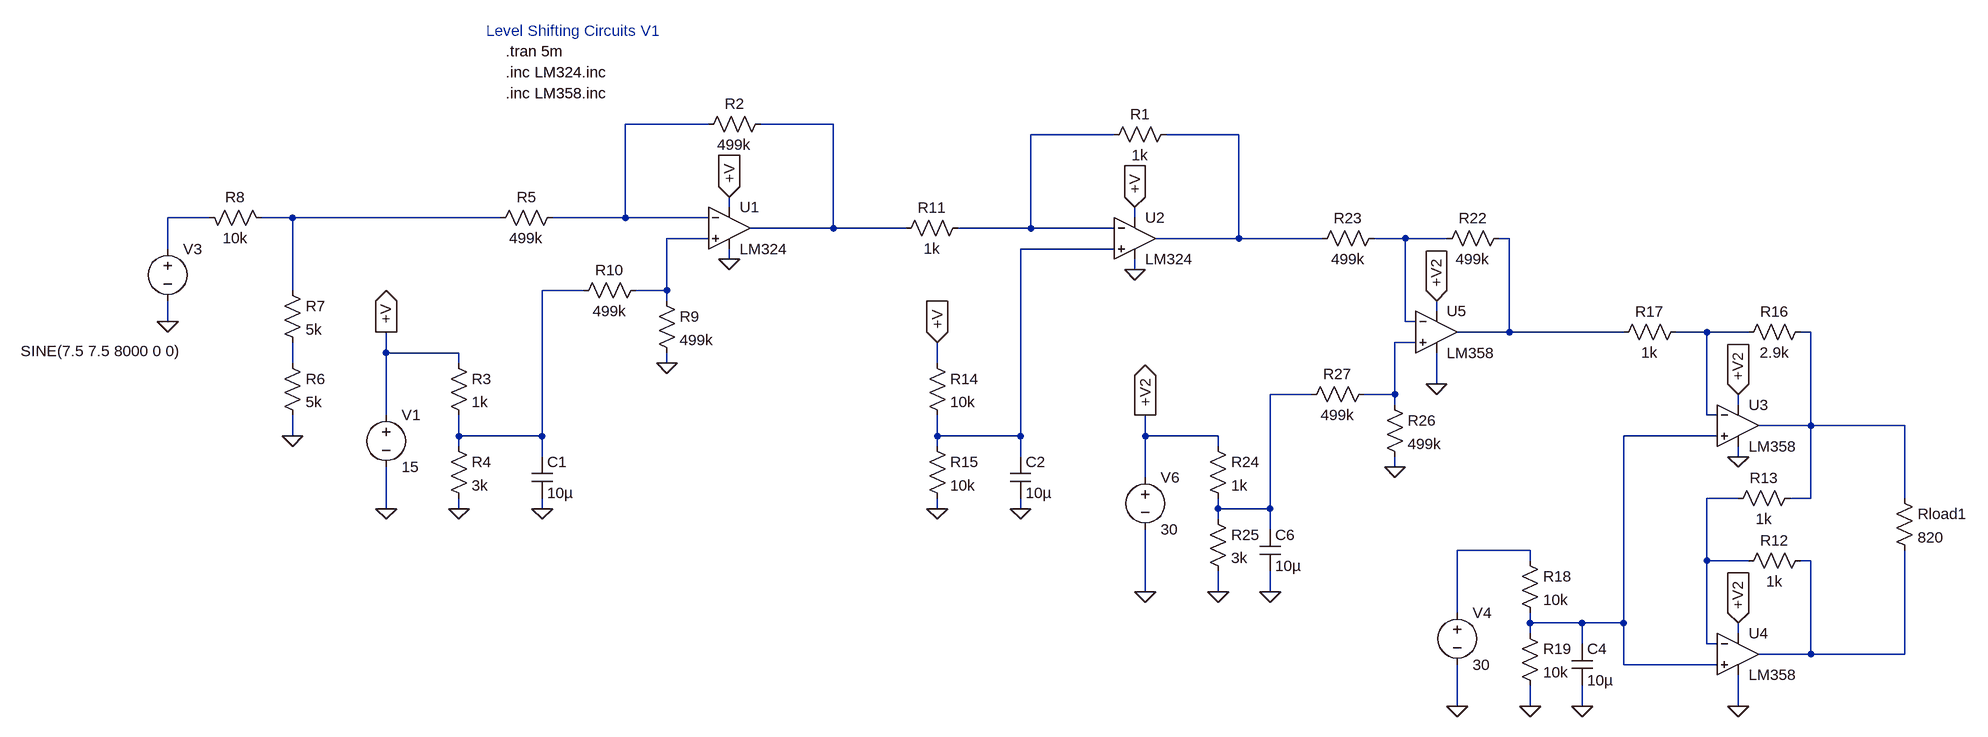
[diagram p0: schematic Level_shifting_opamps_v1.asc]
Level_shifting_opamps_v1.asc, the LTspice schematic file:
Version 4
SHEET 1 2336 1060
WIRE 80 -192 -48 -192
WIRE 272 -192 160 -192
WIRE 704 -176 576 -176
WIRE 896 -176 784 -176
WIRE 112 -64 112 -80
WIRE -688 -48 -752 -48
WIRE -560 -48 -608 -48
WIRE -240 -48 -560 -48
WIRE -48 -48 -48 -192
WIRE -48 -48 -160 -48
WIRE 80 -48 -48 -48
WIRE 736 -48 736 -64
WIRE 272 -32 272 -192
WIRE 272 -32 144 -32
WIRE 384 -32 272 -32
WIRE 576 -32 576 -176
WIRE 576 -32 464 -32
WIRE 704 -32 576 -32
WIRE 80 -16 16 -16
WIRE 896 -16 896 -176
WIRE 896 -16 768 -16
WIRE 1024 -16 896 -16
WIRE 1152 -16 1104 -16
WIRE 1216 -16 1152 -16
WIRE 1312 -16 1296 -16
WIRE -752 0 -752 -48
WIRE 704 0 560 0
WIRE 112 16 112 0
WIRE 736 32 736 16
WIRE -560 64 -560 -48
WIRE -112 64 -176 64
WIRE 16 64 16 -16
WIRE 16 64 -32 64
WIRE 16 80 16 64
WIRE 1200 96 1200 80
WIRE -752 112 -752 80
WIRE 1152 112 1152 -16
WIRE 1168 112 1152 112
WIRE 1312 128 1312 -16
WIRE 1312 128 1232 128
WIRE 1488 128 1312 128
WIRE 1616 128 1568 128
WIRE 1680 128 1616 128
WIRE 1776 128 1760 128
WIRE 1168 144 1136 144
WIRE -416 160 -416 128
WIRE -304 160 -416 160
WIRE -560 176 -560 144
WIRE -304 176 -304 160
WIRE 16 176 16 160
WIRE 432 176 432 144
WIRE 1200 208 1200 160
WIRE 1008 224 944 224
WIRE 1136 224 1136 144
WIRE 1136 224 1088 224
WIRE 1136 240 1136 224
WIRE 1664 240 1664 224
WIRE -416 256 -416 160
WIRE 1616 256 1616 128
WIRE 1632 256 1616 256
WIRE 1776 272 1776 128
WIRE 1776 272 1696 272
WIRE 1920 272 1776 272
WIRE -560 288 -560 256
WIRE -304 288 -304 256
WIRE -176 288 -176 64
WIRE -176 288 -304 288
WIRE 432 288 432 256
WIRE 560 288 560 0
WIRE 560 288 432 288
WIRE 752 288 752 256
WIRE 864 288 752 288
WIRE 1632 288 1488 288
WIRE -304 304 -304 288
WIRE 432 304 432 288
WIRE 864 304 864 288
WIRE -176 320 -176 288
WIRE 560 320 560 288
WIRE 1664 320 1664 304
WIRE 1136 336 1136 320
WIRE 752 352 752 288
WIRE 1664 384 1616 384
WIRE 1776 384 1776 272
WIRE 1776 384 1744 384
WIRE 1920 384 1920 272
WIRE -416 400 -416 336
WIRE -304 400 -304 384
WIRE -176 400 -176 384
WIRE 432 400 432 384
WIRE 560 400 560 384
WIRE 864 400 864 384
WIRE 944 400 944 224
WIRE 944 400 864 400
WIRE 864 416 864 400
WIRE 944 432 944 400
WIRE 1344 464 1232 464
WIRE 1344 480 1344 464
WIRE 1616 480 1616 384
WIRE 1680 480 1616 480
WIRE 1776 480 1760 480
WIRE 752 528 752 432
WIRE 864 528 864 496
WIRE 944 528 944 496
WIRE 1232 560 1232 464
WIRE 1344 576 1344 560
WIRE 1424 576 1344 576
WIRE 1488 576 1488 288
WIRE 1488 576 1424 576
WIRE 1344 592 1344 576
WIRE 1664 592 1664 576
WIRE 1424 608 1424 576
WIRE 1616 608 1616 480
WIRE 1632 608 1616 608
WIRE 1776 624 1776 480
WIRE 1776 624 1696 624
WIRE 1920 624 1920 464
WIRE 1920 624 1776 624
WIRE 1488 640 1488 576
WIRE 1632 640 1488 640
WIRE 1232 704 1232 640
WIRE 1344 704 1344 672
WIRE 1424 704 1424 672
WIRE 1664 704 1664 656
FLAG -416 400 0
FLAG -416 128 +V
IOPIN -416 128 Out
FLAG 112 -80 +V
IOPIN 112 -80 In
FLAG -304 400 0
FLAG 112 16 0
FLAG -560 288 0
FLAG -752 112 0
FLAG -176 400 0
FLAG 16 176 0
FLAG 736 -64 +V
IOPIN 736 -64 In
FLAG 736 32 0
FLAG 432 400 0
FLAG 560 400 0
FLAG 1232 704 0
FLAG 1664 576 +V2
IOPIN 1664 576 In
FLAG 1664 224 +V2
IOPIN 1664 224 In
FLAG 1344 704 0
FLAG 1424 704 0
FLAG 1664 320 0
FLAG 1664 704 0
FLAG 752 528 0
FLAG 752 256 +V2
IOPIN 752 256 Out
FLAG 1200 80 +V2
IOPIN 1200 80 In
FLAG 864 528 0
FLAG 944 528 0
FLAG 1200 208 0
FLAG 1136 336 0
FLAG 432 144 +V
IOPIN 432 144 In
SYMBOL voltage -416 240 R0
WINDOW 123 0 0 Left 2
WINDOW 39 0 0 Left 2
SYMATTR InstName V1
SYMATTR Value 15
SYMBOL res 176 -208 R90
WINDOW 0 0 56 VBottom 2
WINDOW 3 32 56 VTop 2
SYMATTR InstName R2
SYMATTR Value 499k
SYMBOL res -320 160 R0
SYMATTR InstName R3
SYMATTR Value 1k
SYMBOL res -320 288 R0
SYMATTR InstName R4
SYMATTR Value 3k
SYMBOL Opamps\\opamp2 112 -96 R0
SYMATTR InstName U1
SYMATTR Value LM324
SYMATTR SpiceModel LM324
SYMBOL voltage -752 -16 R0
WINDOW 123 0 0 Left 2
WINDOW 39 0 0 Left 2
WINDOW 3 -226 173 Left 2
SYMATTR Value SINE(7.5 7.5 8000 0 0)
SYMATTR InstName V3
SYMBOL res -576 160 R0
SYMATTR InstName R6
SYMATTR Value 5k
SYMBOL res -576 48 R0
SYMATTR InstName R7
SYMATTR Value 5k
SYMBOL res -592 -32 M270
WINDOW 0 32 56 VTop 2
WINDOW 3 0 56 VBottom 2
SYMATTR InstName R8
SYMATTR Value 10k
SYMBOL res -144 -64 R90
WINDOW 0 0 56 VBottom 2
WINDOW 3 32 56 VTop 2
SYMATTR InstName R5
SYMATTR Value 499k
SYMBOL res 0 64 R0
SYMATTR InstName R9
SYMATTR Value 499k
SYMBOL res -16 48 R90
WINDOW 0 0 56 VBottom 2
WINDOW 3 32 56 VTop 2
SYMATTR InstName R10
SYMATTR Value 499k
SYMBOL cap -192 320 R0
SYMATTR InstName C1
SYMATTR Value 10µ
SYMBOL res 800 -192 R90
WINDOW 0 0 56 VBottom 2
WINDOW 3 32 56 VTop 2
SYMATTR InstName R1
SYMATTR Value 1k
SYMBOL Opamps\\opamp2 736 -80 R0
SYMATTR InstName U2
SYMATTR Value LM324
SYMATTR SpiceModel LM324
SYMBOL res 480 -48 R90
WINDOW 0 0 56 VBottom 2
WINDOW 3 32 56 VTop 2
SYMATTR InstName R11
SYMATTR Value 1k
SYMBOL res 416 160 R0
SYMATTR InstName R14
SYMATTR Value 10k
SYMBOL res 416 288 R0
SYMATTR InstName R15
SYMATTR Value 10k
SYMBOL cap 544 320 R0
SYMATTR InstName C2
SYMATTR Value 10µ
SYMBOL voltage 1232 544 R0
WINDOW 123 0 0 Left 2
WINDOW 39 0 0 Left 2
SYMATTR InstName V4
SYMATTR Value 30
SYMBOL res 1776 464 R90
WINDOW 0 0 56 VBottom 2
WINDOW 3 32 56 VTop 2
SYMATTR InstName R12
SYMATTR Value 1k
SYMBOL res 1760 368 R90
WINDOW 0 0 56 VBottom 2
WINDOW 3 32 56 VTop 2
SYMATTR InstName R13
SYMATTR Value 1k
SYMBOL res 1776 112 R90
WINDOW 0 0 56 VBottom 2
WINDOW 3 32 56 VTop 2
SYMATTR InstName R16
SYMATTR Value 2.9k
SYMBOL res 1584 112 R90
WINDOW 0 0 56 VBottom 2
WINDOW 3 32 56 VTop 2
SYMATTR InstName R17
SYMATTR Value 1k
SYMBOL res 1904 368 R0
SYMATTR InstName Rload1
SYMATTR Value 820
SYMBOL res 1328 464 R0
SYMATTR InstName R18
SYMATTR Value 10k
SYMBOL res 1328 576 R0
SYMATTR InstName R19
SYMATTR Value 10k
SYMBOL cap 1408 608 R0
SYMATTR InstName C4
SYMATTR Value 10µ
SYMBOL Opamps\\opamp2 1664 208 R0
SYMATTR InstName U3
SYMATTR Value LM358
SYMATTR SpiceModel LM358
SYMBOL Opamps\\opamp2 1664 560 R0
SYMATTR InstName U4
SYMATTR Value LM358
SYMATTR SpiceModel LM358
SYMBOL voltage 752 336 R0
WINDOW 123 0 0 Left 2
WINDOW 39 0 0 Left 2
SYMATTR InstName V6
SYMATTR Value 30
SYMBOL res 1312 -32 R90
WINDOW 0 0 56 VBottom 2
WINDOW 3 32 56 VTop 2
SYMATTR InstName R22
SYMATTR Value 499k
SYMBOL res 1120 -32 R90
WINDOW 0 0 56 VBottom 2
WINDOW 3 32 56 VTop 2
SYMATTR InstName R23
SYMATTR Value 499k
SYMBOL res 848 288 R0
SYMATTR InstName R24
SYMATTR Value 1k
SYMBOL res 848 400 R0
SYMATTR InstName R25
SYMATTR Value 3k
SYMBOL cap 928 432 R0
SYMATTR InstName C6
SYMATTR Value 10µ
SYMBOL Opamps\\opamp2 1200 64 R0
SYMATTR InstName U5
SYMATTR Value LM358
SYMATTR SpiceModel LM358
SYMBOL res 1120 224 R0
SYMATTR InstName R26
SYMATTR Value 499k
SYMBOL res 1104 208 R90
WINDOW 0 0 56 VBottom 2
WINDOW 3 32 56 VTop 2
SYMATTR InstName R27
SYMATTR Value 499k
TEXT -232 -304 Left 2 !.tran 5m
TEXT -128 -320 Bottom 2 ;Level Shifting Circuits V1
TEXT -232 -272 Left 2 !.inc LM324.inc
TEXT -232 -240 Left 2 !.inc LM358.inc

The netlist it stands for:
* Level_shifting_opamps_v1.asc
V1 +V 0 15
R2 N002 N001 499k
R3 +V N011 1k
R4 N011 0 3k
XU1 N007 N001 +V 0 N002 LM324 LM324  ; pins In+ In- V+ V- OUT
V3 N005 0 SINE(7.5 7.5 8000 0 0)
R6 N015 0 5k
R7 N006 N015 5k
R8 N006 N005 10k
R5 N001 N006 499k
R9 N007 0 499k
R10 N007 N011 499k
C1 N011 0 10µ
R1 N004 N003 1k
XU2 N010 N003 +V 0 N004 LM324 LM324  ; pins In+ In- V+ V- OUT
R11 N003 N002 1k
R14 +V N010 10k
R15 N010 0 10k
C2 N010 0 10µ
V4 N019 0 30
R12 N020 N018 1k
R13 N013 N018 1k
R16 N013 N012 2.9k
R17 N012 N009 1k
Rload1 N013 N020 820
R18 N019 N017 10k
R19 N017 0 10k
C4 N017 0 10µ
XU3 N017 N012 +V2 0 N013 LM358 LM358  ; pins In+ In- V+ V- OUT
XU4 N017 N018 +V2 0 N020 LM358 LM358  ; pins In+ In- V+ V- OUT
V6 +V2 0 30
R22 N009 N008 499k
R23 N008 N004 499k
R24 +V2 N016 1k
R25 N016 0 3k
C6 N016 0 10µ
XU5 N014 N008 +V2 0 N009 LM358 LM358  ; pins In+ In- V+ V- OUT
R26 N014 0 499k
R27 N014 N016 499k
.tran 5m
* Level Shifting Circuits V1
.inc LM324.inc
.inc LM358.inc
.backanno
.end